# EAGLE design CAN-I2C (EAGLE 9.1.1)

## Sheet 1 of 2
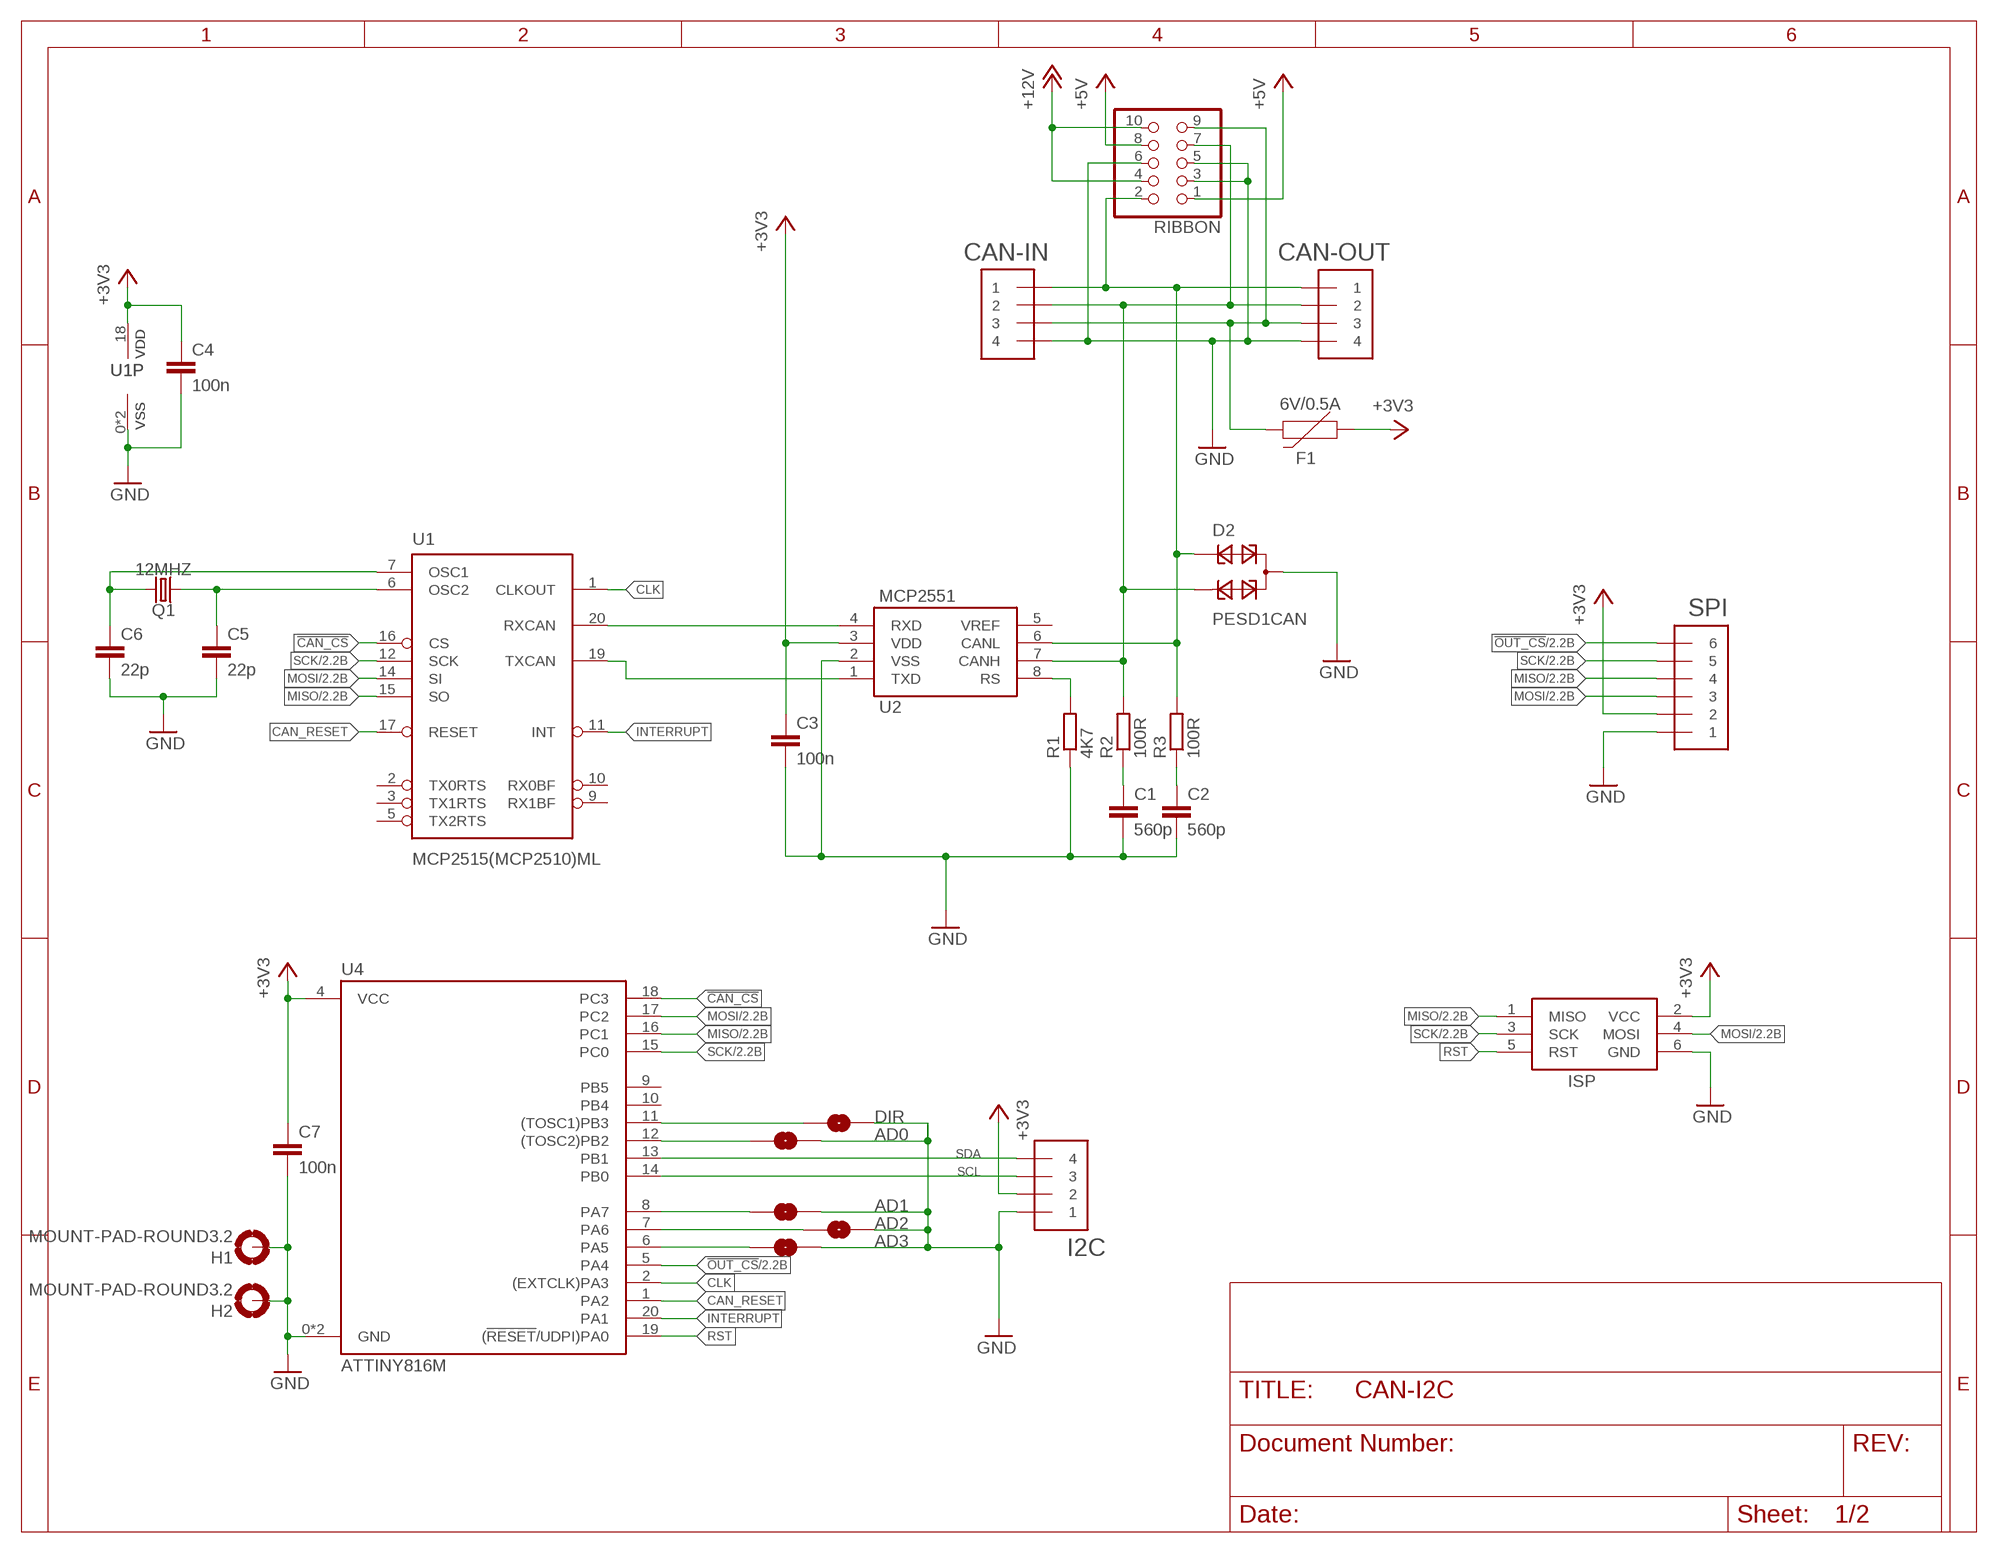
[diagram p0: schematic, sheet 1]

### Parts
AD0  JUMPER-SMT_2_NO_SILK  [SMT-JUMPER_2_NO_SILK]
AD1  JUMPER-SMT_2_NO_SILK  [SMT-JUMPER_2_NO_SILK]
AD2  JUMPER-SMT_2_NO_SILK  [SMT-JUMPER_2_NO_SILK]
AD3  JUMPER-SMT_2_NO_SILK  [SMT-JUMPER_2_NO_SILK]
C1  560p  C-EUC0603  [C0603]
C2  560p  C-EUC0603  [C0603]
C3  100n  C-EUC0603  [C0603]
C4  100n  C-EUC0603  [C0603]
C5  22p  C-EUC0603  [C0603]
C6  22p  C-EUC0603  [C0603]
C7  100n  C-EUC0603  [C0603]
CAN-IN  STRAWSON_EAGLE_LIB_JST_SH_4  [STRAWSON_EAGLE_LIB_JST_SH_4_SMD]
CAN-OUT  STRAWSON_EAGLE_LIB_JST_SH_4  [STRAWSON_EAGLE_LIB_JST_SH_4_SMD]
D2  PESD1CAN  [SOT23]
DIR  JUMPER-SMT_2_NO_SILK  [SMT-JUMPER_2_NO_SILK]
F1  6V/0.5A  PPTC_HALF-AMP  [1206]
H1  MOUNT-PAD-ROUND3.2  [3,2-PAD]
H2  MOUNT-PAD-ROUND3.2  [3,2-PAD]
I2C  STRAWSON_EAGLE_LIB_JST_SH_4  [STRAWSON_EAGLE_LIB_JST_SH_4_SMD]
ISP  AVRISP-6  [AVRISP]
Q1  12MHZ  CRYSTALSMD-3.2X1.5  [CRYSTAL-SMD-3.2X1.5MM]
R1  4K7  R-EU_R0603  [R0603]
R2  100R  R-EU_R0603  [R0603]
R3  100R  R-EU_R0603  [R0603]
RIBBON  PINHD-2X5_2.54-SMD  [2X05SMD]
SPI  STRAWSON_EAGLE_LIB_JST_SH_6  [STRAWSON_EAGLE_LIB_JST_SH_6]
U1  MCP2515(MCP2510)ML  [QFN20]
U2  MCP2551  [SO08]
U4  ATTINY816M  [QFN20]

### Nets
!CAN_CS!: U1.16(CS) U4.18(PC3)
!OUT_CS!: SPI.6 U4.5(PA4) ; also sheet 2
+3V3: C3.1 C4.1 C7.1 F1.1 I2C.2 ISP.2(VCC) SPI.2 U1.18(VDD) U2.3(VDD) U4.4(VCC) ; also sheet 2
+5V: RIBBON.1 RIBBON.8 ; also sheet 2
+12V: RIBBON.4 RIBBON.10 ; also sheet 2
CAN_RESET: U1.17(RESET) U4.1(PA2)
CLK: U1.1(CLKOUT) U4.2((EXTCLK)PA3)
GND: AD0.2 AD1.2 AD2.2 AD3.2 C1.2 C2.2 C3.2 C4.2 C5.2 C6.2 C7.2 CAN-IN.4 CAN-OUT.4 D2.3 DIR.2 H1.B3,2(MOUNT) H2.B3,2(MOUNT) I2C.1 ISP.6(GND) R1.1 RIBBON.3 RIBBON.5 RIBBON.6 SPI.1 U1.0(VSS) U1.8(VSS) U2.2(VSS) U4.0(GND) U4.3(GND) ; also sheet 2
INTERRUPT: U1.11(INT) U4.20(PA1)
MISO: ISP.1(MISO) SPI.4 U1.15(SO) U4.16(PC1) ; also sheet 2
MOSI: ISP.4(MOSI) SPI.3 U1.14(SI) U4.17(PC2) ; also sheet 2
N$1: U1.20(RXCAN) U2.4(RXD)
N$2: U1.19(TXCAN) U2.1(TXD)
N$3: R1.2 U2.8(RS)
N$4: CAN-IN.2 CAN-OUT.2 D2.2 R2.2 RIBBON.7 U2.7(CANH)
N$5: CAN-IN.1 CAN-OUT.1 D2.1 R3.2 RIBBON.2 U2.6(CANL)
N$6: C1.1 R2.1
N$7: C2.1 R3.1
N$8: AD1.1 U4.8(PA7)
N$9: DIR.1 U4.11((TOSC1)PB3)
N$10: C6.1 Q1.P$2 U1.7(OSC1)
N$11: C5.1 Q1.P$1 U1.6(OSC2)
N$12: AD0.1 U4.12((TOSC2)PB2)
N$13: CAN-IN.3 CAN-OUT.3 F1.2 RIBBON.9
N$14: AD2.1 U4.7(PA6)
N$15: AD3.1 U4.6(PA5)
RST: ISP.5(RST) U4.19((!RESET!/UDPI)PA0)
SCK: ISP.3(SCK) SPI.5 U1.12(SCK) U4.15(PC0) ; also sheet 2
SCL: I2C.3 U4.14(PB0) ; also sheet 2
SDA: I2C.4 U4.13(PB1) ; also sheet 2
Unconnected: U1.2(TX0RTS) U1.3(TX1RTS) U1.5(TX2RTS) U1.9(RX1BF) U1.10(RX0BF) U2.5(VREF) U4.9(PB5) U4.10(PB4)

## Sheet 2 of 2
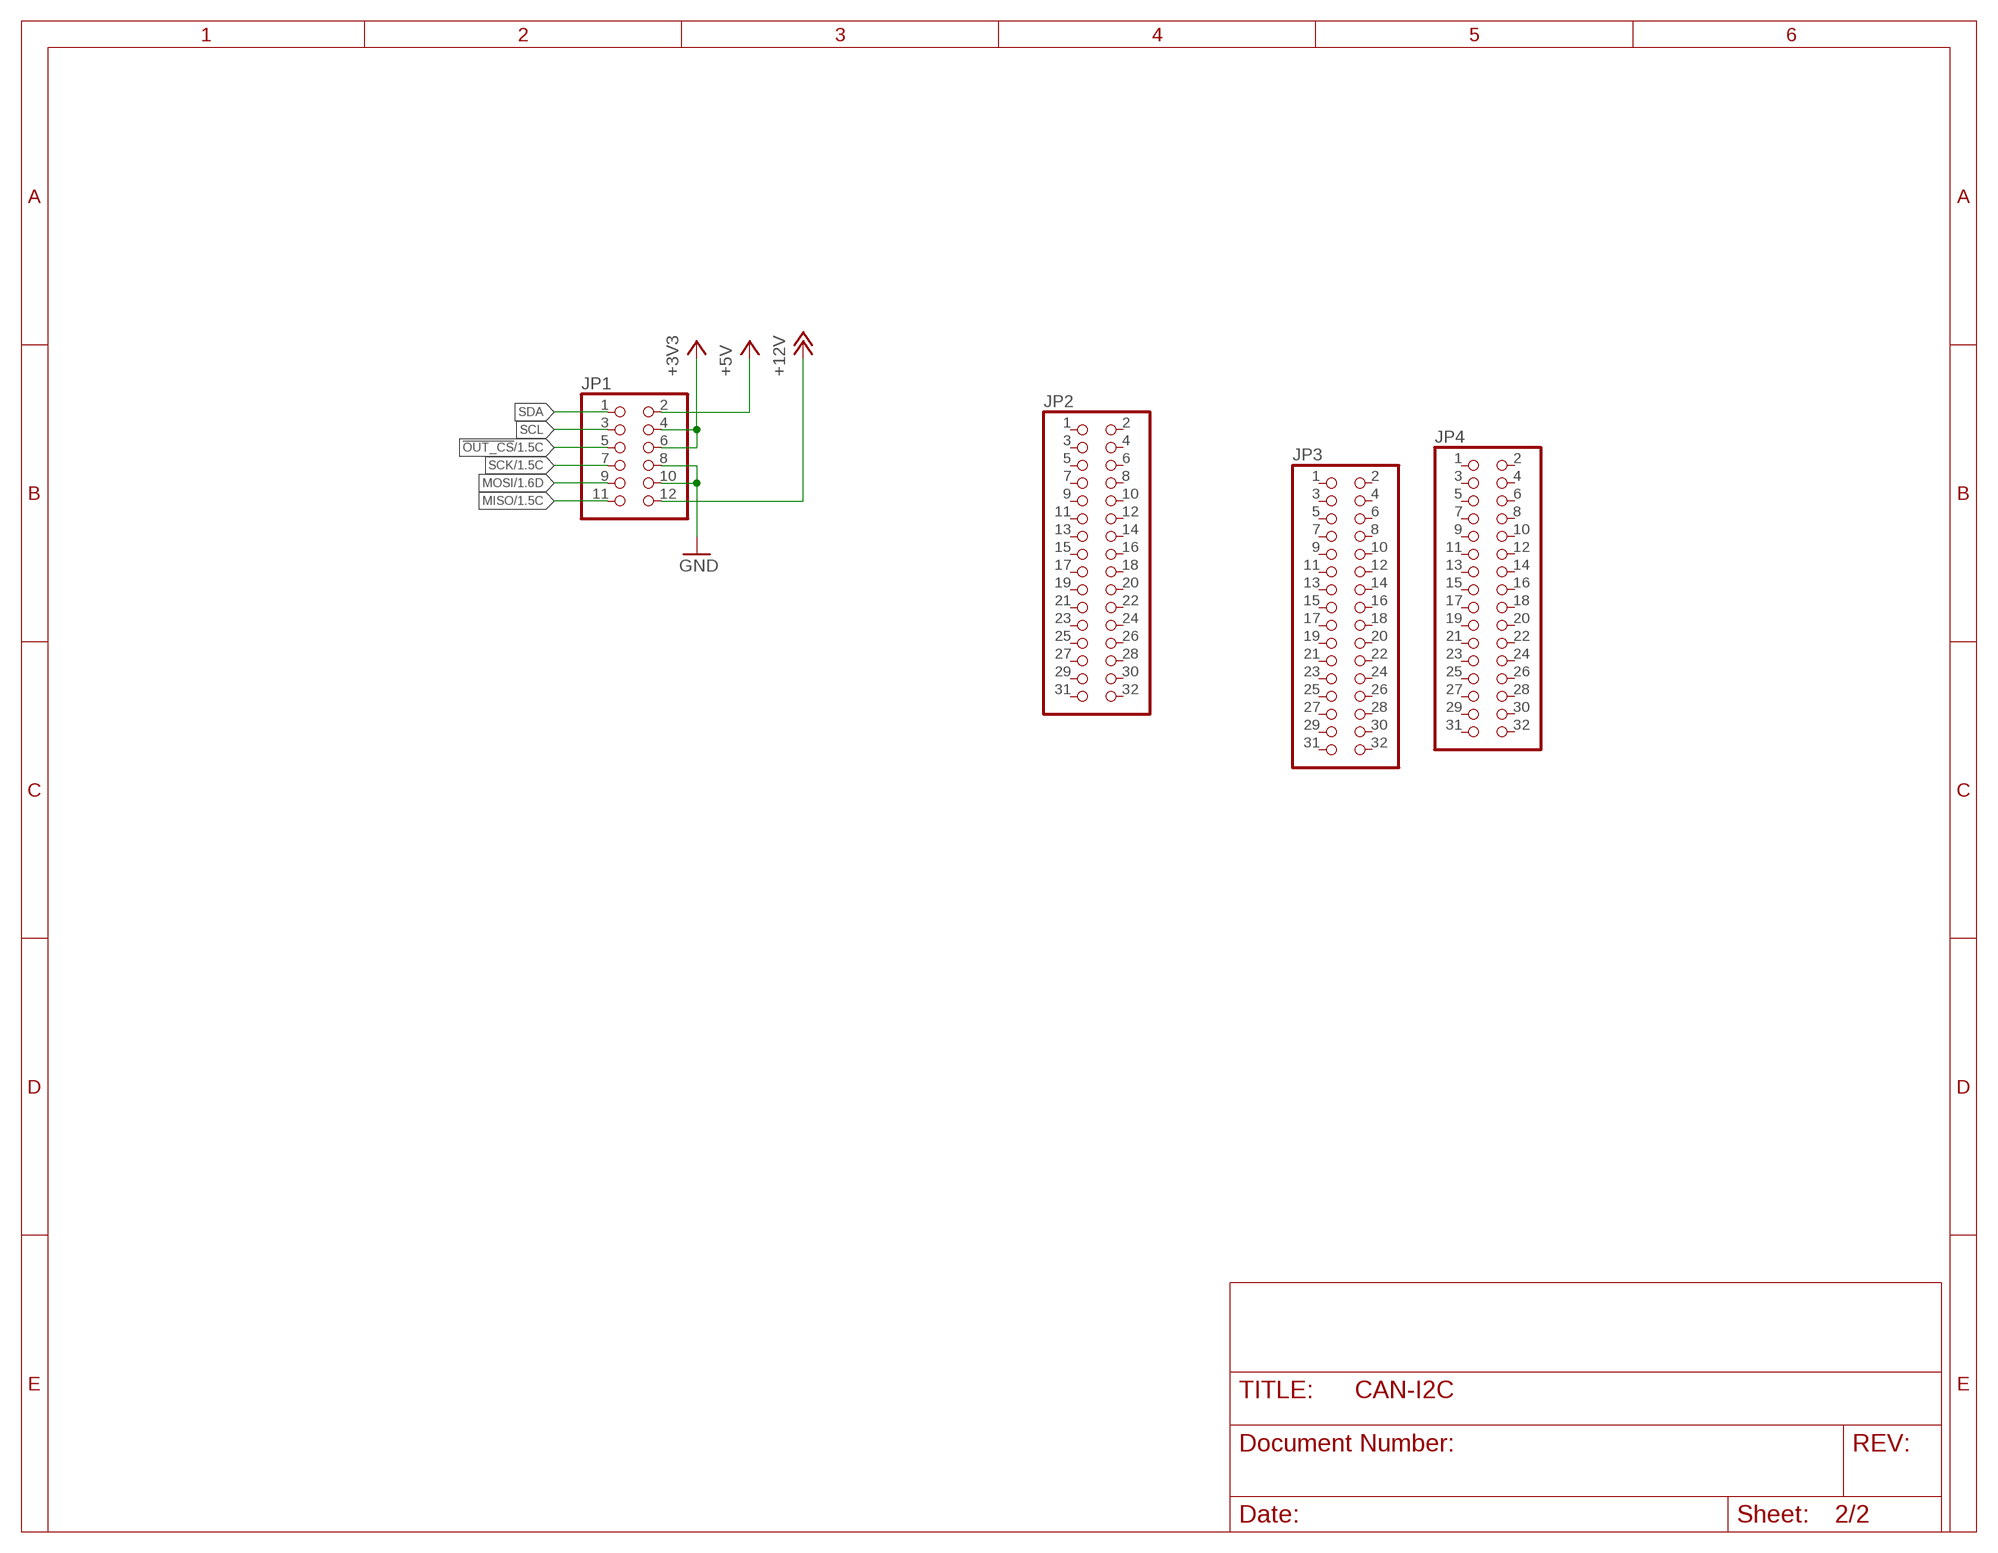
[diagram p1: schematic, sheet 2]

### Parts
JP1  PINHD-2X6  [2X06]
JP2  PINHD-2X16  [2X16]
JP3  PINHD-2X16  [2X16]
JP4  PINHD-2X16  [2X16]

### Nets
!OUT_CS!: JP1.5 ; also sheet 1
+3V3: JP1.4 JP1.6 ; also sheet 1
+5V: JP1.2 ; also sheet 1
+12V: JP1.12 ; also sheet 1
GND: JP1.8 JP1.10 ; also sheet 1
MISO: JP1.11 ; also sheet 1
MOSI: JP1.9 ; also sheet 1
SCK: JP1.7 ; also sheet 1
SCL: JP1.3 ; also sheet 1
SDA: JP1.1 ; also sheet 1
Unconnected: JP2.1 JP2.2 JP2.3 JP2.4 JP2.5 JP2.6 JP2.7 JP2.8 JP2.9 JP2.10 JP2.11 JP2.12 JP2.13 JP2.14 JP2.15 JP2.16 JP2.17 JP2.18 JP2.19 JP2.20 JP2.21 JP2.22 JP2.23 JP2.24 JP2.25 JP2.26 JP2.27 JP2.28 JP2.29 JP2.30 JP2.31 JP2.32 JP3.1 JP3.2 JP3.3 JP3.4 JP3.5 JP3.6 JP3.7 JP3.8 JP3.9 JP3.10 JP3.11 JP3.12 JP3.13 JP3.14 JP3.15 JP3.16 JP3.17 JP3.18 JP3.19 JP3.20 JP3.21 JP3.22 JP3.23 JP3.24 JP3.25 JP3.26 JP3.27 JP3.28 JP3.29 JP3.30 JP3.31 JP3.32 JP4.1 JP4.2 JP4.3 JP4.4 JP4.5 JP4.6 JP4.7 JP4.8 JP4.9 JP4.10 JP4.11 JP4.12 JP4.13 JP4.14 JP4.15 JP4.16 JP4.17 JP4.18 JP4.19 JP4.20 JP4.21 JP4.22 JP4.23 JP4.24 JP4.25 JP4.26 JP4.27 JP4.28 JP4.29 JP4.30 JP4.31 JP4.32

## Library data of the parts
AD0 AD1-AD3 DIR = SparkFun-Jumpers:JUMPER-SMT_2_NO: Normally open jumper This jumper has two pads in close proximity to each other. Apply solder to close the connection. Round pads are easier to solder for beginners, but are a lot larger. SparkFun Product that uses the round pads: SparkFun EL Sequencer <https://www.sparkfun.com/products/12781>
C1-C7 = resistor:C-EU: CAPACITOR, European symbol
CAN-IN CAN-OUT I2C = can-library:STRAWSON_EAGLE_LIB_JST_SH_4
D2 = diode:PESD1CAN: CAN bus ESD protection diode Source: http://www.nxp.com/documents/data_sheet/PESD1CAN.pdf
F1 = SparkFun-Fuses:PPTC: Resettable Fuse PPTC Resettable Fuse. Really a sort of resistor with a polymeric positive temperature coefficient whose resistance increases dramatically with an increase in temperature. When heated by the power passing through the resistance rises causing the current to be limited, protecting the circuit. This is achieved by the transition of the polymer from a crystalline to an amorphous state where the conductive carbon separates breaking the conductive pathways found in the cool crystalline structure. When a PPTC cools back down it resumes conducting letting the circuit turn back on. SparkFun Products: SparkFun RedBoard - Programmed with Arduino <https://www.sparkfun.com/products/12757> Pro Micro - 5V/16MHz <https://www.sparkfun.com/products/12640> Arduino Pro 328 - 5V/16MHz <https://www.sparkfun.com/products/10915> MP3 Trigger <https://www.sparkfun.com/products/13720>; PROD_ID: RES-08585
H1 H2 = holes:MOUNT-PAD-ROUND: MOUNTING PAD, round
ISP = adafruit:AVRISP: AVR ISP HEADER Standard 6 pin header for AVR programming
JP1 = pinhead:PINHD-2X6: PIN HEADER
JP2-JP4 = pinhead:PINHD-2X16: PIN HEADER
Q1 = SparkFun-Clocks:CRYSTAL: Crystals (Generic) These are passive quartz crystals, which can be used as a clock source for a microcontroller. Crystal's are two-terminal devices. They require external "load" capacitors to generate an oscillating signal.
R1-R3 = resistor:R-EU_: RESISTOR, European symbol
RIBBON = pinhead-1:PINHD-2X5: PIN HEADER
SPI = can-library:STRAWSON_EAGLE_LIB_JST_SH_6
U1 = can-library:MCP2515(MCP2510): CAN controller with SPI interface The MCP2515 controller supercedes the MCP2510 while addressing all errata associated with it. The two devices are pin compatible, either can be used with this device. 18-pin package SOIC Simple SPI interface to any MCU. One-shot mode ensures message transmission is attempted only once Databyte filtering Start-of-Frame (SOF) output Low-power CMOS Technology Datasheet <http://www.sparkfun.com/datasheets/DevTools/Arduino/MCP2515.pdf> SparkFun Products CAN-BUS Shield <https://www.sparkfun.com/products/13262> (DEV-13262)
U2 = SparkFun-IC-Comms:MCP2551: MCP2551 High Speed CAN Transceiver High speed CAN transceiver Datasheet <http://www.sparkfun.com/datasheets/DevTools/Arduino/MCP2551.pdf> SparkFun Products CAN-BUS Shield <https://www.sparkfun.com/products/13262> (DEV-13262) SparkFun OBD-II UART <https://www.sparkfun.com/products/9555> (WIG-09555); PROD_ID: IC-09907
U4 = can-library:ATTINY816

## Board
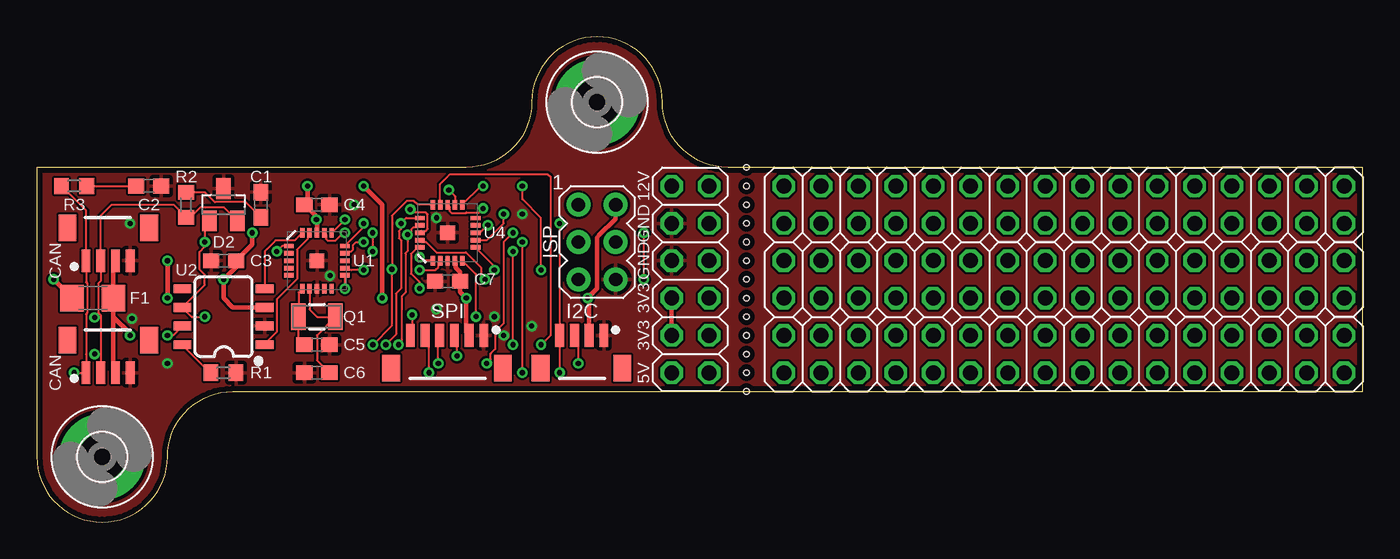
[diagram p2: board, top side]
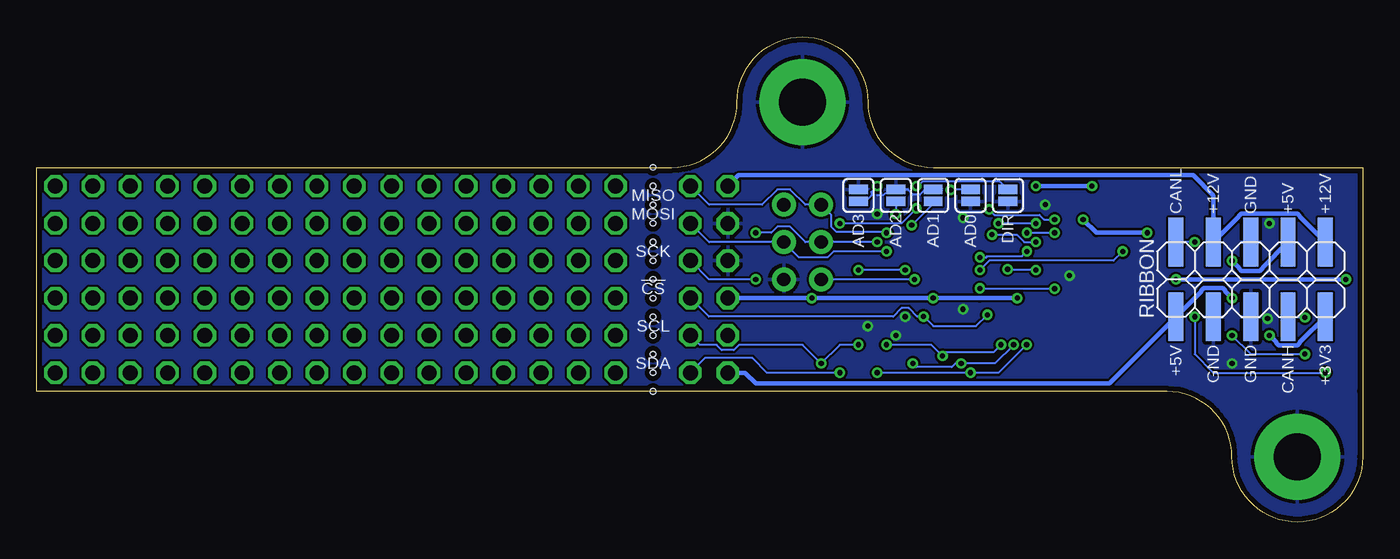
[diagram p3: board, bottom side, seen from below]

Size 90.17 x 33.02 mm. Coordinates in mm from the lower left corner, seen from the top.
Outline: 0,8.89 0,4.45 arc90 4.45,0 arc90 8.89,4.45 arc-90 13.34,8.89 90.17,8.89 90.17,24.13 46.99,24.13 arc-90 42.55,28.57 arc90 38.1,33.02 arc90 33.66,28.57 arc-90 29.21,24.13 0,24.13 0,8.89
Copper layers (1*2*15*16): Top 0.0356mm / dielectric 1.5011mm / layer 2 0.0356mm / dielectric 0.1499mm / layer 15 0.0356mm / dielectric 0.2007mm / Bottom 0.0356mm
Design rules "LaenPCBOrder *": minimum track width 6mil, minimum drill 13mil, track to track 6mil, track to pad 6mil, pad to pad 6mil, via to via 6mil, smd to smd 6mil, copper to edge 15mil, drill to drill 6mil, minimum pad ring 7mil, minimum via ring 7mil, stop-mask expansion 4mil, vias tented up to drill 15mil, thermal gap 10mil
Holes 0.35 mm at 48.26,11.43 48.26,12.7 48.26,13.97 48.26,15.24 48.26,16.51 48.26,17.78 48.26,19.05 48.26,20.32 48.26,21.59 48.26,22.86 48.26,24.13 48.26,10.16 48.26,8.89

### Footprints (pad centres in the part's own frame; a part is rotated, then mirrored left to right if it is on the bottom)
SMT-JUMPER_2_NO_SILK = smd 0.635 x 1.27: 1 -0.406,0; 2 0.406,0
C0603 = smd 1.1 x 1: 1 -0.85,0; 2 0.85,0
STRAWSON_EAGLE_LIB_JST_SH_4_SMD = smd 0.6 x 1.55: 1 0.46,1.27; 2 -0.54,1.27; 3 -1.54,1.27; 4 -2.54,1.27 | smd 1.2 x 1.8: P$1 -3.84,-0.955; P$2 1.728,-0.955
SOT23 = smd 1 x 1.4: 1 -0.95,-1.1; 2 0.95,-1.1; 3 0,1.1
1206 = smd 1.6 x 1.8: 1 -1.4,0; 2 1.4,0
3,2-PAD = drill 3.2 pad 5.842: B3,2 0,0
AVRISP = drill 0.9 pad 1.626: 1 -1.27,2.54; 2 1.27,2.54; 3 -1.27,0; 4 1.27,0; 5 -1.27,-2.54; 6 1.27,-2.54
2X06 = drill 1.016 octagon: 1 -6.35,-1.27; 2 -6.35,1.27; 3 -3.81,-1.27; 4 -3.81,1.27; 5 -1.27,-1.27; 6 -1.27,1.27; 7 1.27,-1.27; 8 1.27,1.27; 9 3.81,-1.27; 10 3.81,1.27; 11 6.35,-1.27; 12 6.35,1.27
2X16 = drill 1.016 octagon: 1 -19.05,-1.27; 2 -19.05,1.27; 3 -16.51,-1.27; 4 -16.51,1.27; 5 -13.97,-1.27; 6 -13.97,1.27; 7 -11.43,-1.27; 8 -11.43,1.27; 9 -8.89,-1.27; 10 -8.89,1.27; 11 -6.35,-1.27; 12 -6.35,1.27; 13 -3.81,-1.27; 14 -3.81,1.27; 15 -1.27,-1.27; 16 -1.27,1.27; 17 1.27,-1.27; 18 1.27,1.27; 19 3.81,-1.27; 20 3.81,1.27; 21 6.35,-1.27; 22 6.35,1.27; 23 8.89,-1.27; 24 8.89,1.27; 25 11.43,-1.27; 26 11.43,1.27; 27 13.97,-1.27; 28 13.97,1.27; 29 16.51,-1.27; 30 16.51,1.27; 31 19.05,-1.27; 32 19.05,1.27
CRYSTAL-SMD-3.2X1.5MM = smd 1 x 1.8: P$1 -1.25,0; P$2 1.25,0
R0603 = smd 1 x 1.1: 1 -0.85,0; 2 0.85,0
2X05SMD = smd 1.016 x 3.302: 1 -1.27,-3.81; 2 -1.27,1.27; 3 1.27,-3.81; 4 1.27,1.27; 5 3.81,-3.81; 6 3.81,1.27; 7 6.35,-3.81; 8 6.35,1.27; 9 8.89,-3.81; 10 8.89,1.27
STRAWSON_EAGLE_LIB_JST_SH_6 = smd 0.6 x 1.55: 1 5,0; 2 4,0; 3 3,0; 4 2,0; 5 1,0; 6 0,0 | smd 1.2 x 1.8: P$1 -1.3,-2.225; P$2 6.3,-2.225
QFN20 = smd 1 x 1: 0 0,0 | smd 0.65 x 0.3: 1 -1.9,1; 2 -1.9,0.5; 3 -1.9,0; 4 -1.9,-0.5; 5 -1.9,-1; 11 1.9,-1; 12 1.9,-0.5; 13 1.9,0; 14 1.9,0.5; 15 1.9,1 | smd 0.3 x 0.65: 6 -1,-1.9; 7 -0.5,-1.9; 8 0,-1.9; 9 0.5,-1.9; 10 1,-1.9; 16 1,1.9; 17 0.5,1.9; 18 0,1.9; 19 -0.5,1.9; 20 -1,1.9
SO08 = smd 0.6 x 1.2: 1 -1.905,-2.8; 2 -0.635,-2.8; 3 0.635,-2.8; 4 1.905,-2.8; 5 1.905,2.8; 6 0.635,2.8; 7 -0.635,2.8; 8 -1.905,2.8

### Placement (x,y rotation side)
AD0  26.67,22.23 270 bottom
AD1  29.21,22.23 90 bottom
AD2  31.75,22.23 90 bottom
AD3  34.29,22.23 90 bottom
C1  15.24,21.59 90 top
C2  7.62,22.86 0 top
C3  12.7,17.78 180 top
C4  19.05,21.59 0 top
C5  19.05,12.06 0 top
C6  19.05,10.16 180 top
C7  27.94,16.38 180 top
CAN-IN  3.81,19.05 180 top
CAN-OUT  3.81,11.43 180 top
D2  12.7,21.59 0 top
DIR  24.13,22.23 270 bottom
F1  3.81,15.24 0 top
H1  4.45,4.45 0 top
H2  38.1,28.57 0 top
I2C  38.1,11.43 0 top
ISP  38.1,19.05 0 top
JP1  44.45,16.51 90 top
JP2  69.85,11.43 0 top
JP3  69.85,21.59 0 top
JP4  69.85,16.51 0 top
Q1  19.05,13.97 0 top
R1  12.7,10.16 180 top
R2  10.16,21.59 270 top
R3  2.54,22.86 180 top
RIBBON  11.43,17.78 0 bottom
SPI  25.4,12.7 0 top
U1  19.05,17.78 0 top
U2  12.7,13.97 90 top
U4  27.94,19.68 90 top

### Tracks (layer width: path | path; a pad name or v marks a point on that pad's centre or on a via)
!CAN_CS!  (via drill 0.35)
  Top 0.152: U1.16 v20.95,20.59 | v25.4,21.27 25.6,21.06 26.46,21.06 26.59,20.93 26.59,19.94 26.46,19.81 26.16,19.81 U4.18
  Bottom 0.152: v20.95,20.59 21.67,20.59 21.98,20.9 25.04,20.9 v25.4,21.27
!OUT_CS!  (via drill 0.35)
  Top 0.152: U4.5 29.84,16.88 29.84,13.97 29.86,13.97 v29.87,13.98 | v25.53,14.1 25.53,12.83 SPI.6
  Bottom 0.152: v25.53,14.1 26.29,13.34 29.21,13.34 29.86,13.98 v29.87,13.98 30.3,13.98 30.87,14.55 31.36,14.55 31.93,13.98 44.46,13.98 JP1.5
+3V3  (via drill 0.35)
  Top 0.305: F1.1 v1.14,16.51 | U2.3 13.34,14.61 12.7,15.24 v12.7,16.51 13.55,17.36 C3.1 14.65,18.89 v14.65,19.68 | 19.05,20.61 19.05,20.74 C4.1 18.41,21.8 v18.41,22.86 | v19.02,20.58 19.05,20.61 | v23.5,15.24 23.5,19.05 23.5,21.59 v22.23,22.86 | SPI.2 29.21,12.89 v29.21,15.24 28.79,15.66 28.79,15.88 | I2C.2 37.56,15.14 v37.47,15.24 38.1,15.88 38.1,19.36 38.25,19.51 39.37,20.63 ISP.2 | 28.79,15.88 C7.1 | U4.4 28.48,17.74 28.48,17.33 28.79,17.03 28.79,15.88 | JP1.6 JP1.4 | U1.18 19.05,20.61
  Bottom 0.305: v1.14,16.51 v12.7,16.51 | v14.65,19.68 18.12,19.68 v19.02,20.58 | v23.5,15.24 26.04,15.24 v29.21,15.24 v37.47,15.24 JP1.6 | v18.41,22.86 v22.23,22.86
+5V  (via drill 0.35)
  Top 0.305: v8.89,17.78 v8.89,15.24
  Bottom 0.305: v8.89,17.78 8.43,17.32 8.43,17.27 8.25,17.09 6.99,17.09 6.81,17.27 6.81,17.32 RIBBON.8 | v8.89,15.24 9.35,15.7 9.35,15.75 9.53,15.93 10.79,15.93 10.97,15.75 10.97,15.7 RIBBON.1 17.25,9.42 41.27,9.42 42.01,10.16 JP1.2
+12V
  Bottom 0.305: RIBBON.10 4.27,20.78 4.27,20.83 4.45,21.01 8.25,21.01 8.43,20.83 8.43,20.78 RIBBON.4 10.16,22.23 11.53,23.6 42.44,23.6 JP1.12
CAN_RESET  (via drill 0.35)
  Top 0.152: U1.17 19.67,19.56 19.67,19.26 19.8,19.13 20.3,19.13 20.85,19.68 v20.95,19.68 | U4.1 26.25,17.79 v26.04,18 | v22.84,18.41 22.86,18.44 22.86,19.66 v22.84,19.68
  Bottom 0.152: v22.84,19.68 v20.95,19.68 | v26.04,18 25.61,18 25.53,18.09 23.17,18.09 v22.84,18.41
CLK  (via drill 0.35)
  Top 0.152: U1.1 16.68,18.78 v16.32,18.41 | U4.2 27.32,17.66 27.32,17.36 27.1,17.14 v26.04,17.14
  Bottom 0.152: v16.32,18.41 16.95,17.78 25.4,17.78 v26.04,17.14
GND  (via drill 0.35)
  Bottom 0.152: AD1.2 29.76,22.63 30.11,22.28 30.59,22.28 30.94,22.63 AD2.2 32.02,22.36 32.48,22.36 32.62,22.23 33.02,22.23
  other vias: 6.35,20.32 31.75,12.7 27.18,20.7 21.59,21.59 19.94,16.76 8.89,10.79 6.48,13.84 31.11,13.97 27.18,14.48 33.02,20.95 33.66,13.34
  pour Top: 0,-1.91 91.44,-1.91 91.44,34.29 0,34.29
  pour Bottom: 0,-0.64 0,33.66 90.81,33.66 90.81,-0.64
INTERRUPT  (via drill 0.35)
  Top 0.152: v20.95,15.88 U1.11 | v26.04,15.9 26.04,16.32 25.45,16.9 25.45,18.24 25.79,18.58 25.94,18.58 U4.20
  Bottom 0.152: v26.04,15.9 26.01,15.88 25.4,15.88 v20.95,15.88
MISO  (via drill 0.35)
  Top 0.152: U1.15 22.23,20.05 v22.23,20.32 | U4.16 25.13,20.68 v24.77,20.32 24.77,19.93 24.63,19.79 24.63,19.31 24.77,19.17 24.77,15.88 24.43,15.54 24.43,12.76 v23.74,12.06 | v27.3,10.79 27.3,12.61 SPI.4 | v30.59,10.79 30.87,11.07 30.87,11.47 31.17,11.77 31.17,12.94 31.75,13.52 31.75,19.05 v32.38,19.68
  Bottom 0.152: v22.23,20.32 v24.77,20.32 | v23.74,12.06 25.01,10.79 v27.3,10.79 27.69,10.79 27.94,10.54 30.35,10.54 30.48,10.67 v30.59,10.79 | v32.38,19.68 32.44,19.74 35.8,19.74 36.14,20.08 36.14,20.9 ISP.1 37.9,21.59 38.94,22.63 39.8,22.63 40.84,21.59 44.45,21.59 JP1.11
MOSI  (via drill 0.35)
  Top 0.152: v22.23,19.05 21.72,19.05 21.5,18.83 21.5,18.54 21.37,18.4 21.07,18.4 U1.14 | U4.17 25.92,20.06 25.62,20.06 25.49,19.93 25.49,19.63 25.41,19.55 v25.21,19.55 25.21,18.43 25.07,18.29 25.07,15.61 24.82,15.35 24.82,12.29 v24.59,12.06 | v28.57,11.3 28.57,12.53 SPI.3 | v32.38,12.06 v32.38,18.41
  Bottom 0.152: v25.21,19.55 23.53,19.55 23.02,19.05 v22.23,19.05 | v32.38,18.41 35.99,18.41 36.4,18.01 38.33,18.01 ISP.4 44.45,19.05 JP1.9 | v24.59,12.06 25.09,11.57 28.31,11.57 v28.57,11.3 29.34,12.06 v32.38,12.06
N$1
  Top 0.152: U1.20 17.53,19.16 16.24,19.16 15.5,18.42 U2.4
N$2
  Top 0.152: U1.19 18.43,19.56 18.43,19.26 17.7,18.54 17.7,16.54 16.33,15.16 16.33,12.94 15.5,12.11 U2.1
N$3
  Top 0.152: U2.8 11.8,10.16 R1.2
N$4  (via drill 0.35)
  Top 0.152: 4.35,13.97 4.35,14.08 4.18,14.24 4.18,16.23 4.35,16.4 CAN-IN.2 4.35,20.86 5.08,21.59 9.31,21.59 R2.2 10.48,20.74 11.15,21.42 12.72,21.42 D2.2 | 4.35,13.97 4.35,11.43 | 4.35,11.43 CAN-OUT.2 | U2.7 9.27,12.7 v8.89,12.7 | v3.93,11.43 4.35,11.43 | v3.93,13.92 3.99,13.97 4.35,13.97
  Bottom 0.152: v3.93,11.43 7.62,11.43 v8.89,12.7 | RIBBON.7 3.99,13.97 v3.93,13.92
N$5  (via drill 0.35)
  Top 0.152: R3.2 3.35,21.2 CAN-IN.1 3.35,16.32 3.44,16.23 3.44,14.24 3.35,14.16 3.35,11.43 CAN-OUT.1 v2.54,10.16 | D2.1 11.43,20.17 v11.43,19.05 11.43,18.73 11.07,18.38 11.07,17.18 11.43,16.83 11.43,16.14 U2.6 10.54,13.97 v11.43,13.97
  Bottom 0.152: v11.43,19.05 RIBBON.2 | v11.43,13.97 11.43,11.43 10.16,10.16 v2.54,10.16
N$6
  Top 0.152: R2.1 11.43,22.44 12.11,21.76 14.22,21.76 C1.1
N$7
  Top 0.152: R3.1 C2.1
N$8  (via drill 0.35)
  Top 0.152: U4.8 30.16,19.68 v30.67,20.2
  Bottom 0.152: v30.67,20.2 29.21,21.66 AD1.1
N$9  (via drill 0.35)
  Top 0.152: v30.35,22.86 30.21,22.86 U4.11
  Bottom 0.152: v30.35,22.86 30.26,22.86 29.94,23.18 24.68,23.18 DIR.1
N$10
  Top 0.152: C6.1 19.05,11.01 19.05,12.7 20.3,13.95 Q1.P$2 19.05,13.97 18.55,14.47 U1.7
N$11
  Top 0.152: U1.6 17.8,15.63 Q1.P$1 17.8,12.46 C5.1
N$12  (via drill 0.35)
  Top 0.152: v28.02,22.6 28.44,22.18 U4.12
  Bottom 0.152: AD0.1 27.99,22.63 v28.02,22.6
N$13  (via drill 0.35)
  Top 0.305: CAN-IN.3 5.21,17.64 F1.2 5.21,13.97 | CAN-OUT.3 5.21,10.3 5.21,13.97 | v6.35,12.7 6.35,12.83 5.21,13.97
  Bottom 0.305: v6.35,12.7 5.89,12.24 5.89,12.19 5.71,12.01 4.45,12.01 4.27,12.19 4.27,12.24 RIBBON.9
N$14  (via drill 0.35)
  Top 0.152: U4.7 30.61,19.18 31.75,20.32 v31.75,20.95
  Bottom 0.152: AD2.1 v31.75,20.95
N$15  (via drill 0.35)
  Top 0.152: U4.6 31.11,17.41 v31.11,17.14 | v34.29,17.14 34.29,20.69 33.02,21.96 v33.02,22.86
  Bottom 0.152: v31.11,17.14 v34.29,17.14 | v33.02,22.86 33.43,22.45 33.43,22.22 33.83,21.82 AD3.1
RST  (via drill 0.35)
  Top 0.152: U4.19 26.16,19.06 26.46,19.06 27.18,18.34 29.18,18.34 30.2,17.32 30.2,16.79 v30.48,16.51
  Bottom 0.152: v30.48,16.51 ISP.5
SCK  (via drill 0.35)
  Top 0.152: U4.15 25.9,21.59 25.64,21.85 25.16,21.85 24.15,20.84 v24.15,17.2 24.13,17.18 24.13,13.34 v22.86,12.06 | v22.23,17.14 21.38,17.14 21.37,17.16 21.07,17.16 U1.12 | v26.67,10.16 26.67,12.43 SPI.5 | v33.02,10.16 v33.02,19.05 | v41.27,19.68 v41.27,16.51
  Bottom 0.152: v24.15,17.2 22.28,17.2 v22.23,17.14 | v22.86,12.06 24.77,10.16 v26.67,10.16 v33.02,10.16 | v33.02,19.05 ISP.3 37.9,19.05 38.94,20.09 39.8,20.09 40.21,19.68 v41.27,19.68 | v41.27,16.51 44.45,16.51 JP1.7
SCL  (via drill 0.35)
  Top 0.152: U4.14 27.44,23 28.12,23.67 34.75,23.67 34.92,23.5 34.92,12.7 v34.29,12.06 | v36.83,10.79 36.83,12.43 I2C.3
  Bottom 0.152: v34.29,12.06 35.56,12.06 v36.83,10.79 38.1,12.06 42.41,12.06 42.77,11.71 43.59,11.71 43.95,12.06 45.09,12.06 JP1.3
SDA  (via drill 0.35)
  Top 0.152: U4.13 28.06,21.46 28.06,21.16 28.2,21.03 29.18,21.03 29.22,21.06 30.07,21.06 v30.35,21.34 | v35.56,20.32 I2C.4 v35.56,10.16
  Bottom 0.152: v30.35,21.34 31.37,20.32 v35.56,20.32 | v35.56,10.16 40.51,10.16 41.5,11.15 44.73,11.15 JP1.1

### Text on the board
tPlace: 12V | GND | CAN | GND | 3V3 | 3V3 | CAN | 5V
bPlace: MISO | +12V | +5V | GND | +12V | CANL | MOSI | SCK | !CS! | SCL | +3V3 | CANH | GND | GND | +5V | SDA